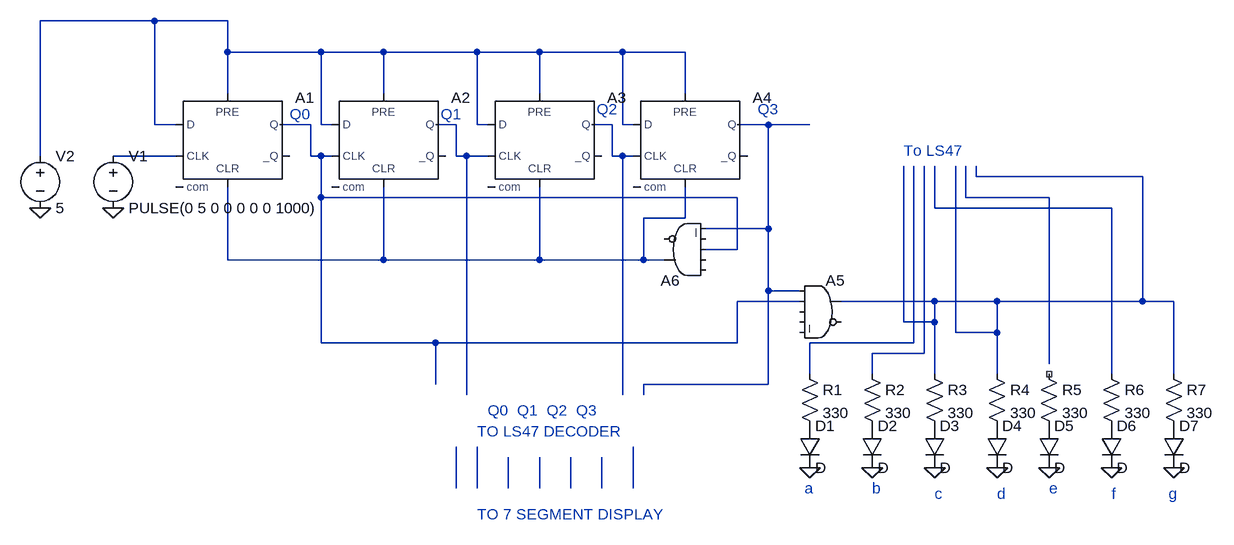
[diagram p0: schematic OctalCounter-7SegDisplay.asc]
OctalCounter-7SegDisplay.asc, the LTspice schematic file:
Version 4
SHEET 1 1620 744
WIRE -16 -32 -192 -32
WIRE 96 -32 -16 -32
WIRE 96 16 96 -32
WIRE 240 16 96 16
WIRE 336 16 240 16
WIRE 480 16 336 16
WIRE 576 16 480 16
WIRE 704 16 576 16
WIRE 800 16 704 16
WIRE 96 80 96 16
WIRE 336 80 336 16
WIRE 576 80 576 16
WIRE 800 80 800 16
WIRE -16 128 -16 -32
WIRE 16 128 -16 128
WIRE 224 128 176 128
WIRE 240 128 240 16
WIRE 256 128 240 128
WIRE 448 128 416 128
WIRE 480 128 480 16
WIRE 496 128 480 128
WIRE 688 128 656 128
WIRE 704 128 704 16
WIRE 720 128 704 128
WIRE 928 128 880 128
WIRE 992 128 928 128
WIRE -192 176 -192 -32
WIRE 16 176 -80 176
WIRE 224 176 224 128
WIRE 240 176 224 176
WIRE 256 176 240 176
WIRE 448 176 448 128
WIRE 464 176 448 176
WIRE 496 176 464 176
WIRE 688 176 688 128
WIRE 704 176 688 176
WIRE 720 176 704 176
WIRE 1248 208 1248 192
WIRE 1504 208 1248 208
WIRE 240 240 240 176
WIRE 880 240 240 240
WIRE 1232 240 1232 192
WIRE 1360 240 1232 240
WIRE 1184 256 1184 192
WIRE 1456 256 1184 256
WIRE 800 272 800 224
WIRE 800 272 736 272
WIRE 928 288 928 128
WIRE 928 288 832 288
WIRE 880 320 880 240
WIRE 880 320 832 320
WIRE 96 336 96 224
WIRE 336 336 336 224
WIRE 336 336 96 336
WIRE 576 336 576 224
WIRE 576 336 336 336
WIRE 736 336 736 272
WIRE 736 336 576 336
WIRE 768 336 736 336
WIRE 928 384 928 288
WIRE 976 384 928 384
WIRE 976 400 880 400
WIRE 1184 400 1040 400
WIRE 1280 400 1184 400
WIRE 1504 400 1504 208
WIRE 1504 400 1280 400
WIRE 1552 400 1504 400
WIRE 1136 432 1136 192
WIRE 1184 432 1184 400
WIRE 1184 432 1136 432
WIRE 1216 448 1216 192
WIRE 1280 448 1280 400
WIRE 1280 448 1216 448
WIRE 240 464 240 240
WIRE 416 464 240 464
WIRE 880 464 880 400
WIRE 880 464 416 464
WIRE 1152 464 1152 192
WIRE 1152 464 992 464
WIRE 1168 480 1168 192
WIRE 1168 480 1088 480
WIRE 1360 496 1360 240
WIRE 992 512 992 464
WIRE 1088 512 1088 480
WIRE 1184 512 1184 432
WIRE 1280 512 1280 448
WIRE 1456 512 1456 256
WIRE 1552 512 1552 400
WIRE 416 528 416 464
WIRE 928 528 928 384
WIRE 928 528 736 528
WIRE 464 544 464 176
WIRE 704 544 704 176
WIRE 736 544 736 528
WIRE 448 688 448 624
WIRE 480 688 480 624
WIRE 528 688 528 640
WIRE 576 688 576 640
WIRE 624 688 624 640
WIRE 672 688 672 640
WIRE 720 688 720 624
FLAG -80 256 0
FLAG -192 256 0
FLAG 992 656 0
FLAG 1088 656 0
FLAG 1184 656 0
FLAG 1280 656 0
FLAG 1360 656 0
FLAG 1456 656 0
FLAG 1552 656 0
SYMBOL Digital\\dflop 96 80 R0
SYMATTR InstName A1
SYMBOL Digital\\dflop 336 80 R0
SYMATTR InstName A2
SYMBOL Digital\\dflop 576 80 R0
SYMATTR InstName A3
SYMBOL Digital\\dflop 800 80 R0
SYMATTR InstName A4
SYMBOL Digital\\and 1008 352 R0
SYMATTR InstName A5
SYMBOL voltage -80 160 R0
WINDOW 123 0 0 Left 0
WINDOW 39 0 0 Left 0
SYMATTR InstName V1
SYMATTR Value PULSE(0 5 0 0 0 0 0 1000)
SYMBOL voltage -192 160 R0
WINDOW 123 0 0 Left 0
WINDOW 39 0 0 Left 0
SYMATTR InstName V2
SYMATTR Value 5
SYMBOL res 976 496 R0
SYMATTR InstName R1
SYMATTR Value 330
SYMBOL res 1072 496 R0
SYMATTR InstName R2
SYMATTR Value 330
SYMBOL res 1168 496 R0
SYMATTR InstName R3
SYMATTR Value 330
SYMBOL res 1264 496 R0
SYMATTR InstName R4
SYMATTR Value 330
SYMBOL res 1344 496 R0
SYMATTR InstName R5
SYMATTR Value 330
SYMBOL res 1440 496 R0
SYMATTR InstName R6
SYMATTR Value 330
SYMBOL res 1536 496 R0
SYMATTR InstName R7
SYMATTR Value 330
SYMBOL diode 976 592 R0
SYMATTR InstName D1
SYMBOL diode 1072 592 R0
SYMATTR InstName D2
SYMBOL diode 1168 592 R0
SYMATTR InstName D3
SYMBOL diode 1264 592 R0
SYMATTR InstName D4
SYMBOL diode 1344 592 R0
SYMATTR InstName D5
SYMBOL diode 1536 592 R0
SYMATTR InstName D7
SYMBOL diode 1440 592 R0
SYMATTR InstName D6
SYMBOL Digital\\and 800 384 R180
SYMATTR InstName A6
TEXT 496 568 Left 2 ;Q0  Q1  Q2  Q3
TEXT 984 688 Left 2 ;a
TEXT 1088 688 Left 2 ;b
TEXT 1184 696 Left 2 ;c
TEXT 1280 696 Left 2 ;d
TEXT 1360 688 Left 2 ;e
TEXT 1456 696 Left 2 ;f
TEXT 1544 696 Left 2 ;g
TEXT 192 112 Left 2 ;Q0
TEXT 424 112 Left 2 ;Q1
TEXT 664 104 Left 2 ;Q2
TEXT 912 104 Left 2 ;Q3
TEXT 480 728 Left 2 ;TO 7 SEGMENT DISPLAY
TEXT 1136 168 Left 2 ;To LS47
TEXT 480 600 Left 2 ;TO LS47 DECODER

The netlist it stands for:
* OctalCounter-7SegDisplay.asc
A1 N001 0 N006 N001 N010 0 N002 0 DFLOP
A2 N001 0 N002 N001 N010 0 N003 0 DFLOP
A3 N001 0 N003 N001 N010 0 N004 0 DFLOP
A4 N001 0 N004 N001 N010 0 N005 0 DFLOP
A5 N005 N002 0 0 0 0 N007 0 AND
V1 N006 0 PULSE(0 5 0 0 0 0 0 1000)
V2 N001 0 5
R1 N011 P001 330
R2 N012 P002 330
R3 N007 P003 330
R4 N007 P004 330
R5 NC_01 P005 330
R6 N009 P006 330
R7 N007 P007 330
D1 P001 0 D
D2 P002 0 D
D3 P003 0 D
D4 P004 0 D
D5 P005 0 D
D7 P007 0 D
D6 P006 0 D
A6 0 0 N002 0 N005 0 N010 0 AND
.model D D
.lib standard.dio
* Q0  Q1  Q2  Q3
* a
* b
* c
* d
* e
* f
* g
* Q0
* Q1
* Q2
* Q3
* TO 7 SEGMENT DISPLAY
* To LS47
* TO LS47 DECODER
.backanno
.end